# Altium schematic sheet 3.MOTOR.SchDoc
size A4
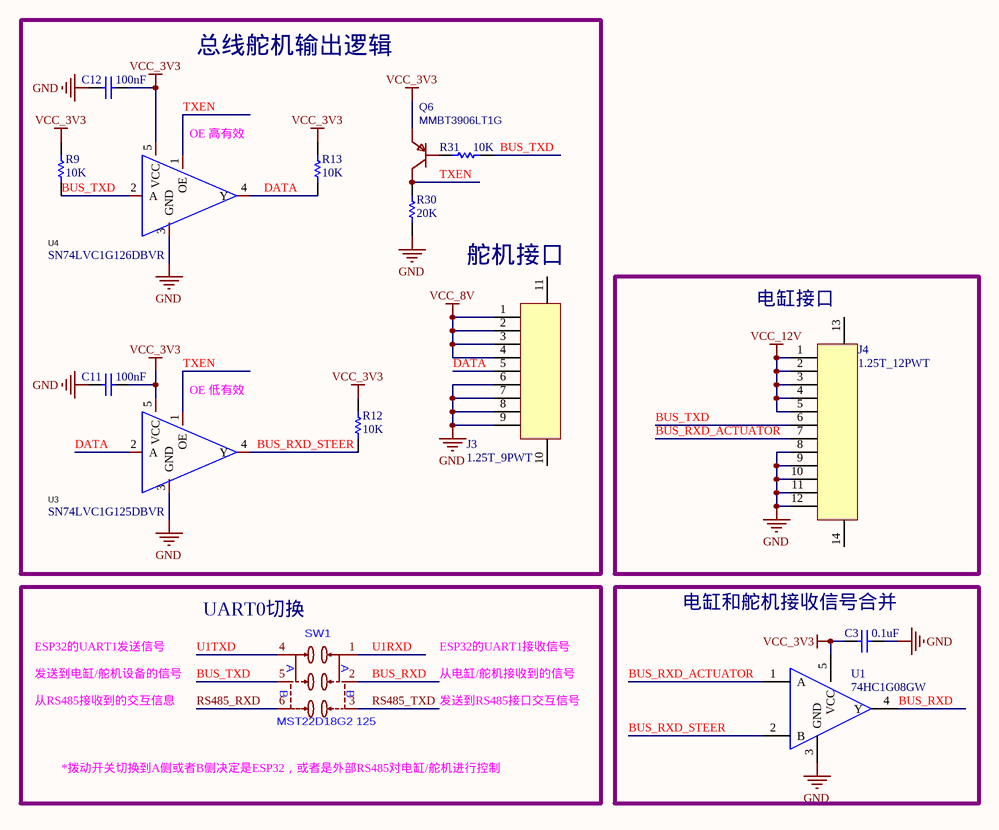
[diagram p0: 3.MOTOR.SchDoc]

## Parts
C3  0.1uF  [0402]
C11  100nF  [0402]
C12  100nF  [0402]
J3  1.25T_9PWT  [CONN-SMD_9P-P1.25_SHOU-HAN_1.25-9P-WT]
J4  1.25T_12PWT  [CONN-SMD_12P-P1.25_HCTL_HC-1.25-12PWT]
Q6  MMBT3906LT1G  [SOT-23-3_L2.9-W1.3-P1.90-LS2.4-BR]
R9  10K  [0402]
R12  10K  [0402]
R13  10K  [0402]
R30  20K  [0402]
R31  10K  [0402]
SW1  MST22D18G2 125  [SW-SMD_MST22D18G2]
U1  74HC1G08GW  [SOT-353_L2.1-W1.3-P0.65-LS2.3-BR]
U3  SN74LVC1G125DBVR  [SOT23-5]
U4  SN74LVC1G126DBVR  [SOT23-5]

## Blocks framed on the sheet
电缸接口: J4
UART0切换: SW1
电缸和舵机接收信号合并: C3 U1

## Nets
GND: C3.1 C11.2 C12.2 J3.6 J3.7 J3.8 J3.9 J4.8 J4.9 J4.10 J4.11 J4.12 R30.2 U1.3(GND) U3.3(GND) U4.3(GND)
VCC_3V3: C3.2 C11.1 C12.1 Q6.2(E) R9.2 R12.2 R13.2 U1.5(VCC) U3.5(VCC) U4.5(VCC)
VCC_8V: J3.1 J3.2 J3.3 J3.4
VCC_12V: J4.1 J4.2 J4.3 J4.4 J4.5
BUS_RXD: SW1.2 U1.4(Y)
BUS_RXD_ACTUATOR: J4.7 U1.1(A)
BUS_RXD_STEER: R12.1 U1.2(B) U3.4(Y)
BUS_TXD: J4.6 R9.1 R31.1 SW1.5 U4.2(A)
DATA: J3.5 R13.1 U3.2(A) U4.4(Y)
RS485_RXD: SW1.6
RS485_TXD: SW1.3
TXEN: Q6.3(C) R30.1 U3.1(OE) U4.1(OE)
U1RXD: SW1.1
U1TXD: SW1.4
NetQ6_1: Q6.1(B) R31.2

Not connected (* = marked no-connect by the designer): J3 10 11; J4 13 14

## Notes on the sheet
- 总线舵机输出逻辑
- (near U4) OE 高有效
- (near J3) 舵机接口
- (near U3) OE 低有效
- ESP32的UART1发送信号
- ESP32的UART1接收信号
- 从RS485接收到的交互信息
- 发送到电缸/舵机设备的信号
- 从电缸/舵机接收到的信号
- 发送到RS485接口交互信号
- *拨动开关切换到A侧或者B侧决定是ESP32，或者是外部RS485对电缸/舵机进行控制
- (in symbol MST22D18G2 125) A; B

## Library data of the parts
C3 C11 C12 = Cap: Capacitor; PartNumber: CAP100NF; Published: 8-Jun-2000; LatestRevisionDate: 17-Jul-2002; LatestRevisionNote: Re-released for DXP Platform.; PackageReference: 0402; Publisher: Altium Limited
  C3: Value: 0.1uF
  C11 C12: Value: 100nF
J3 = 1.25T_9P: JLC NO: C5340796
J4 = 1.25T_12P: JLC NO: C2937184
Q6 = S8550_C545533: Contributor: LCSC; BOM_Supplier: LCSC; BOM_Supplier Part: C53444; BOM_Manufacturer Part: MMBT3906LT1G; BOM_JLCPCB Part Class: Extended Part; spicePre: Q; spiceSymbolName: MMBT3906LT1G
R9 R12 R13 R30 R31 = Res1: Resistor; PartNumber: RES2.2K; Published: 8-Jun-2000; LatestRevisionDate: 17-Jul-2002; LatestRevisionNote: Re-released for DXP Platform.; PackageReference: 0402; Publisher: Altium Limited
  R9 R12 R13 R31: Value: 10K
  R30: Value: 20K
U1 = 74HC1G08: JLC NO: C12500
U3 U4 = 74LVC1G126GW,125: Add into BOM: yes; Supplier Footprint: SOT-23-5; JLCPCB Part Class: Extended Part; Supplier: LCSC; Convert to PCB: yes
  U3: Name: SN74LVC1G125DBVR; Symbol: SN74LVC1G125DBVR; Device: SN74LVC1G125DBVR; LCSC Part Name: SN74LVC1G125DBVR; JLC NO: C23654; Manufacturer Part: SN74LVC1G125DBVR
  U4: Name: SN74LVC1G126DBVR; Symbol: SN74LVC1G126DBVR; Device: SN74LVC1G126DBVR; LCSC Part Name: SN74LVC1G126DBVR; JLC NO: C7834; Manufacturer Part: SN74LVC1G126DBVR
SW1 = MST22D18G2 125: JLC NO: C2906280